# EasyEDA Pro project ProProject_AD9833.epro, board PCB2
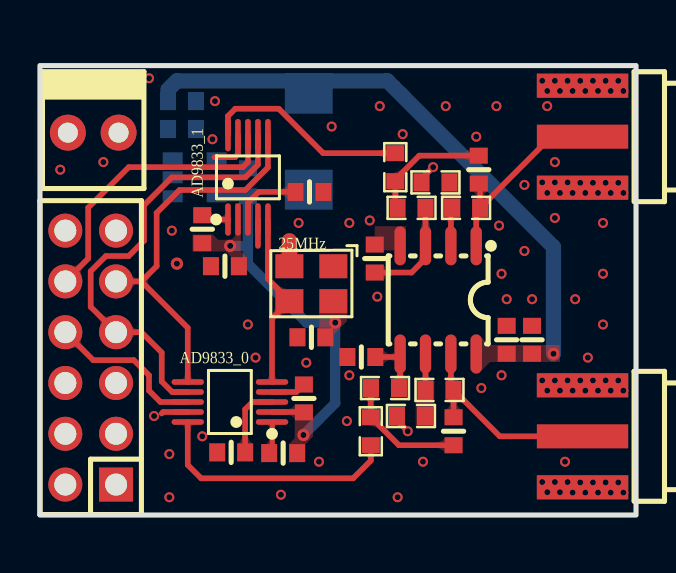
[diagram p6: board, top side]
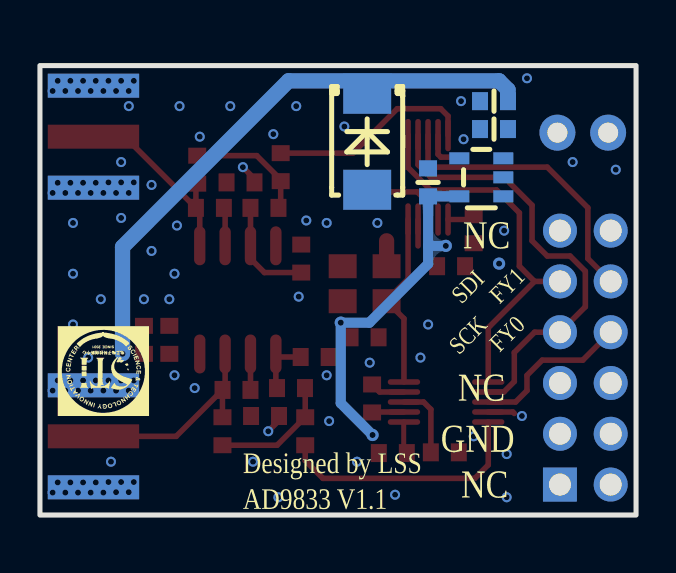
[diagram p7: board, bottom side, seen from below]

Outline 29.84 x 22.48 mm; copper layers: Top Layer, Bottom Layer. Coordinates in mm from the lower left corner of the outline.
Outline path: rectangle 0,22.48 29.84,0
Stack: Top Layer 0.035mm / Dielectric1 1.51mm FR4 er 4.5 / Bottom Layer 0.035mm

## Design rules (mm)
template: 自定义配置
spacing copperThickness1oz (default): track to track 0.102, other pairs 0.152 to 0.3
spacing copperThickness2oz: track to track 0.203, other pairs 0.152 to 0.3
track width copperThickness1oz (default): min 0.127, default 0.254, max 2.54
track width copperThickness2oz: min 0.203, default 0.254, max 2.54
differential pair differentialPair (default): width min 0.127, default 0.254, max 2.54; gap min 0.152, default 0.152
via viaSize (default): diameter min 0.5, default 0.61, max 10; hole min 0.3, default 0.305, max 6.299
net +5V uses 直连

## Placement (name value [footprint] x y rotation side)
25MHz  25MHz  [OSC-SMD_4P-L3.2-W2.5-BL]  13.59 11.57 180 top
AD9833_0  AD9833WBRMZ-REEL  [MSOP-10_L3.0-W3.0-P0.50-LS5.0-BL]  9.51 5.65 90 top
AD9833_1  AD9833WBRMZ-REEL  [MSOP-10_L3.0-W3.0-P0.50-LS5.0-BL]  10.41 16.89 0 top
C1  10nF  [C0603]  12.18 3.1 180 top
C2  10nF  [C0603]  8.13 14.3 90 top
C3  10uF  [C0603]  7.11 20.7 180 bottom
C4  100nF  [C0603]  13.22 5.83 270 top
C5  100nF  [C0603]  9.26 12.45 0 top
C7  100nF  [C0603]  24.64 8.76 270 top
C8  100nF  [C0603]  13.59 8.89 0 top
C9  100nF  [C0603]  9.57 3.13 0 top
C10  100nF  [C0603]  13.49 16.16 180 top
C11  1uF  [C0603]  7.11 19.3 0 bottom
C12  1uF  [C0603]  10.41 16.64 270 bottom
C13  100nF  [C0603]  23.37 8.76 270 top
C14  1.5pF  [C0603]  16.76 12.83 270 top
C15  1.1pF  [C0603]  21.97 17.27 270 top
C16  1.5pF  [C0603]  16.09 7.9 0 top
C17  1.1pF  [C0603]  20.71 4.19 90 top
D4  SMBJ5.0A  [SMB_L4.4-W3.6-LS5.3-RD]  13.46 18.67 270 bottom
H3  PZ254V-12-12P  [HDR-TH_12P-P2.54-V-M-R2-C6-S2.54]  2.54 7.87 90 top
Power1  -  [KF2510_2P]  2.67 19.12 0 top
R9  10k  [R0603]  19.8 16.64 0 top
R10  10k  [R0603]  21.34 15.36 0 top
R11  10k  [R0603]  18.6 15.36 180 top
R13  10k  [R0603]  17.79 17.4 90 top
R14  10k  [R0603]  18.58 4.95 0 top
R15  10k  [R0603]  20 6.26 0 top
R16  10k  [R0603]  17.28 6.35 180 top
R18  10k  [R0603]  16.56 4.19 270 top
RF1  BWSMA-KE-P001  [SMA-SMD_BWSMA-KE-P001]  27.05 3.94 0 top
RF2  BWSMA-KE-P001  [SMA-SMD_BWSMA-KE-P001]  27.05 18.92 0 top
U6  TPLP5907MFX-3.3  [SOT-23-5_L2.9-W1.6-P0.95-LS2.8-BR]  7.75 16.89 180 bottom
U7  OPA2350UA/2K5G4  [SOIC-8_L5.0-W4.0-P1.27-LS6.1-BL]  19.94 10.76 180 top

## Footprints (pads in the part's own frame, mm; a bottom-side part is the same pattern mirrored in y, then rotated)
C0603
  rect 0.8x0.9 smd: 1(-0.7,0) 2(0.7,0)
HDR-TH_12P-P2.54-V-M-R2-C6-S2.54
  rect 1.7x1.7 hole 1.1: 1(-6.35,-1.27)
  round 1.7 hole 1.1: 2(-6.35,1.27) 3(-3.81,-1.27) 4(-3.81,1.27) 5(-1.27,-1.27) 6(-1.27,1.27) 7(1.27,-1.27) 8(1.27,1.27) 9(3.81,-1.27) 10(3.81,1.27) 11(6.35,-1.27) 12(6.35,1.27)
KF2510_2P
  rrect 1.8x1.8 hole 1: 1(-1.27,0) 2(1.27,0)
MSOP-10_L3.0-W3.0-P0.50-LS5.0-BL
  oval 0.28x1.62 smd: 1(-1,-2.11) 2(-0.5,-2.11) 3(0,-2.11) 4(0.5,-2.11) 5(1,-2.11) 6(1,2.11) 7(0.5,2.11) 8(0,2.11) 9(-0.5,2.11) 10(-1,2.11)
OSC-SMD_4P-L3.2-W2.5-BL
  rect 1.4x1.2 smd: 1(-1.1,-0.875) 2(1.1,-0.875) 3(1.1,0.875) 4(-1.1,0.875)
R0603
  rect 0.8x0.9 smd: 1(-0.7,0) 2(0.7,0)
SMA-SMD_BWSMA-KE-P001
  rect 4.572x1.2 smd: 1(0.115,-2.55) 2(0.115,2.55) 5(0.115,0)
  rect 4.572x1.2 smd far side: 3(0.115,2.55) 4(0.115,-2.55)
SMB_L4.4-W3.6-LS5.3-RD
  rect 2x2.4 smd: 1(-2.4,0) 2(2.4,0)
SOIC-8_L5.0-W4.0-P1.27-LS6.1-BL
  oval 0.569x1.95 smd: 1(-1.905,-2.705) 2(-0.635,-2.705) 3(0.635,-2.705) 4(1.905,-2.705) 5(1.905,2.705) 6(0.635,2.705) 7(-0.635,2.705) 8(-1.905,2.705)
SOT-23-5_L2.9-W1.6-P0.95-LS2.8-BR
  rect 1x0.6 smd: 1(1.1,-0.95) 2(1.1,0) 3(1.1,0.95) 4(-1.1,0.95) 5(-1.1,-0.95)

## Nets
As in the schematic.

Pads without a net: 25MHz 1; H3 1 2 5 6 11 12; U6 4

## Via types
v1: diameter 0.5, hole 0.299, Top Layer to Bottom Layer, 104 vias
v2: diameter 0.61, hole 0.305, Top Layer to Bottom Layer, 5 vias

## Routing (per net, layer and track width the routed paths; a pad name or vN(x,y) marks a point on that pad's centre or on a via; arc(x,y) is an arc through that point)
+5V: length 28.8
  Bottom Layer w0.762: C3.2 6.41,21.27 6.86,21.72 17.4,21.72 25.71,13.41 v2(25.71,8.07)
GND: length 9.9
  Top Layer w0.28: AD9833_1.9 9.91,18.04 9.77,17.9 8.74,17.9 ; AD9833_0.9 6.17,5.15 6.1,5.08 ; R14.1 17.88,4.73 v1(18.41,4.19) ; R9.1 19.1,16.82 v1(19.69,17.4) ; C4.1 12.84,6.15 AD9833_0.4 ; AD9833_1.4 10.91,13.46
  Top Layer w0.762: 25MHz.2 12.49,13.72
  vias: v1(1.02,17.27) v1(3.18,17.65) v1(5.46,21.84) v1(5.72,4.95) v1(6.48,3.05) v1(6.48,0.89) v1(6.6,14.22) v1(8.13,3.94) v1(8.64,18.8) v1(8.76,20.7) v1(10.41,9.53) v1(10.79,7.87) v1(12.06,1.02) v1(12.95,14.61) v1(13.34,7.62) v1(13.97,2.67) v1(14.6,19.43) v1(15.37,4.7) v1(15.49,14.61) v1(15.49,6.99) v1(16.51,14.73) v1(16.89,10.92) v1(17.01,20.45) v1(17.91,0.89) v1(18.16,19.05) v1(19.18,2.67) v1(20.32,20.45) v1(21.84,18.92) v1(22.1,6.35) v1(22.86,20.45) v1(22.99,14.48) v1(23.11,12.07) v1(23.11,6.99) v1(23.37,10.8) v1(24.26,16.51) v1(24.26,13.21) v1(24.64,10.8) v1(25.15,21.72) v1(25.15,16.64) v1(25.15,6.73) v1(25.15,1.65) v1(25.4,21.21) v1(25.4,20.45) v1(25.4,16.11) v1(25.4,6.22) v1(25.4,1.14) v1(25.78,21.72) v1(25.78,17.65) v1(25.78,16.64) v1(25.78,14.86) v1(25.78,6.73) v1(25.78,1.65) v1(26.03,21.21) v1(26.03,16.11) v1(26.03,6.22) v1(26.03,1.14) v1(26.29,2.67) v1(26.42,21.72) v1(26.42,16.64) v1(26.42,6.73) v1(26.42,1.65) v1(26.67,21.21) v1(26.67,16.11) v1(26.67,6.22) v1(26.67,1.12) v1(26.8,10.8) v1(27.05,21.72) v1(27.05,16.62) v1(27.05,6.73) v1(27.05,1.63) v1(27.31,21.21) v1(27.31,16.11) v1(27.31,6.22) v1(27.31,1.12) v1(27.43,7.87) v1(27.69,21.72) v1(27.69,16.62) v1(27.69,6.73) v1(27.69,1.63) v1(27.94,21.21) v1(27.94,16.11) v1(27.94,6.22) v1(27.94,1.12) v1(28.19,14.61) v1(28.19,12.07) v1(28.19,9.53) v1(28.32,21.72) v1(28.32,16.62) v1(28.32,6.73) v1(28.32,1.63) v1(28.57,21.21) v1(28.57,16.11) v1(28.57,6.22) v1(28.57,1.12) v1(28.96,21.72) v1(28.96,16.62) v1(28.96,6.73) v1(28.96,1.63) v1(29.21,21.21) v1(29.21,16.11) v1(29.21,6.22) v1(29.21,1.12) v2(6.86,12.57)
VCC: length 19.3
  Top Layer w0.28: AD9833_0.2 13.15,5.15 13.2,5.1
  Bottom Layer w0.508: v2(9.53,13.46) 10.4,13.46 10.41,13.45 ; 10.41,15.94 10.41,13.45 ; 10.41,15.94 C12.2 ; 10.41,15.94 U6.5 ; 10.41,13.45 10.41,12.56 13.35,9.62 v2(14.78,9.62) 14.78,5.59 v2(13.19,4)
CAP0: length 3.7
  Top Layer w0.28: AD9833_0.3 10.64,5.65 10.27,5.28 10.27,3.06
CAP1: length 3.6
  Top Layer w0.28: AD9833_1.3 10.41,15.62 10.95,16.16 12.95,16.16
COMP0: length 1.6
  Top Layer w0.254: AD9833_0.1 11.63,4.64 11.63,3.1
COMP1: length 1.4
  Top Layer w0.28: AD9833_1.1 8.34,14.78 C2.2
FYNC0: length 8
  Top Layer w0.28: AD9833_0.8 6.03,5.65 5.46,6.22 5.46,6.98 4.7,7.75 2.67,7.75 H3.8
FYNC1: length 14.5
  Top Layer w0.28: AD9833_1.8 10.41,17.66 10.16,17.4 4.44,17.4 2.41,15.37 2.41,12.83 H3.10
MCLK: length 8.9
  Top Layer w0.28: AD9833_0.5 11.62,9.83 25MHz.3 12.49,10.73 11.41,11.81 AD9833_1.5
SCK: length 22.4
  Top Layer w0.28: AD9833_0.7 6.62,6.15 6.1,6.68 6.1,8.13 5.08,9.14 H3.7 2.54,10.41 2.54,12.19 3.3,12.95 4.44,12.95 5.21,13.72 5.21,15.49 6.6,16.89 10.29,16.89 10.91,17.52 AD9833_1.7
SDI: length 19.1
  Top Layer w0.28: H3.9 5.08,11.68 ; 5.08,11.68 5.84,12.45 5.84,15.11 6.99,16.26 10.29,16.26 11.41,17.38 AD9833_1.6 ; 5.08,11.68 7.4,9.36 AD9833_0.6
SIG0: length 11.4
  Top Layer w0.28: U7.7 20.57,6.39 R15.2 20.71,6.25 ; 27.93,3.94 23.02,3.94 20.71,6.25 ; C17.2 20.71,6.25
SIG1: length 10.6
  Top Layer w0.28: R10.2 21.84,15.17 U7.1 ; R10.2 22.04,16.51 C15.2 ; R10.2 25.6,18.92 27.93,18.92
VOUT0: length 12.7
  Top Layer w0.28: AD9833_0.10 7.4,2.51 8.07,1.83 15.68,1.83 16.56,2.72 R18.2
VOUT1: length 10.4
  Top Layer w0.28: R13.2 14.18,18.1 11.96,20.32 9.78,20.32 9.41,19.95 AD9833_1.10
$1N2894: length 1.9
  Top Layer w0.28: R10.1 20.57,15.3 U7.2
$1N3186: length 1.8
  Top Layer w0.28: U7.6 R15.1
$1N4984: length 5.5
  Top Layer w0.28: 19.43,13.59 19.43,12.95 18.6,12.13 C14.2 ; R11.1 U7.3
$1N4997: length 6.1
  Top Layer w0.28: R11.2 17.79,15.47 R13.1 17.79,16.78 18.99,17.97 C15.1
$1N5066: length 3
  Top Layer w0.28: C16.2 17.88,7.9 U7.5 18.03,6.41 R16.1
$1N5107: length 6.2
  Top Layer w0.28: R16.2 16.56,6.34 R18.1 16.57,4.89 17.97,3.49 C17.1

## Copper pours and planes (outline as drawn; the poured copper is in the pictures)
+5V on Top Layer: 21.55,9.03 26.03,9.03 26.03,7.08 21.55,7.08
+5V on Bottom Layer: 3.05,20.07 4.86,20.07 5.97,21.17 6.99,21.17 6.99,18.9 7.6,18.29 7.75,18.29 7.75,15.37 6.27,15.37 5.99,15.64 5.99,16.26 7.24,16.26 7.37,16.38 7.37,17.27 6.48,18.16 3.28,18.16 3.05,18.39
GND on Top Layer: 0,22.48 29.84,22.48 29.84,0 0,0
GND on Top Layer: 16.76,14.45 18.33,14.45 18.33,13.24 16.76,13.24
GND on Bottom Layer: 0,22.48 29.84,22.48 29.84,0 0,0
VCC on Top Layer: 13.97,11.3 15.37,11.3 15.37,8.48 13.97,8.48
VCC on Top Layer: 12.47,5.53 13.68,5.53 13.68,2.64 12.47,2.64
VCC on Top Layer: 7.64,15.6 10.37,15.6 10.37,11.99 7.64,11.99
$1N2894 on Top Layer: 20.12,17.11 21.05,17.11 21.05,14.89 20.12,14.89
$1N3186 on Top Layer: 18.82,6.72 19.74,6.72 19.74,4.48 18.82,4.48

Small or netless copper shapes (teardrops, artwork), in the pictures only: 67 on Top Layer, 6 on Bottom Layer

## Text on the board
Bottom Silkscreen Layer: FY1 | FY0 | SDI | SCK | Designed by LSS / AD9833 V1.1 | NC | GND
